# Altium schematic sheet STB_ValidationBoard.SchDoc: STB Validation Board
size A3; Author: mayerph; DrawnBy: mayerph; Organization: PBL; Revision: A; SheetNumber: 1; SheetTotal: 4
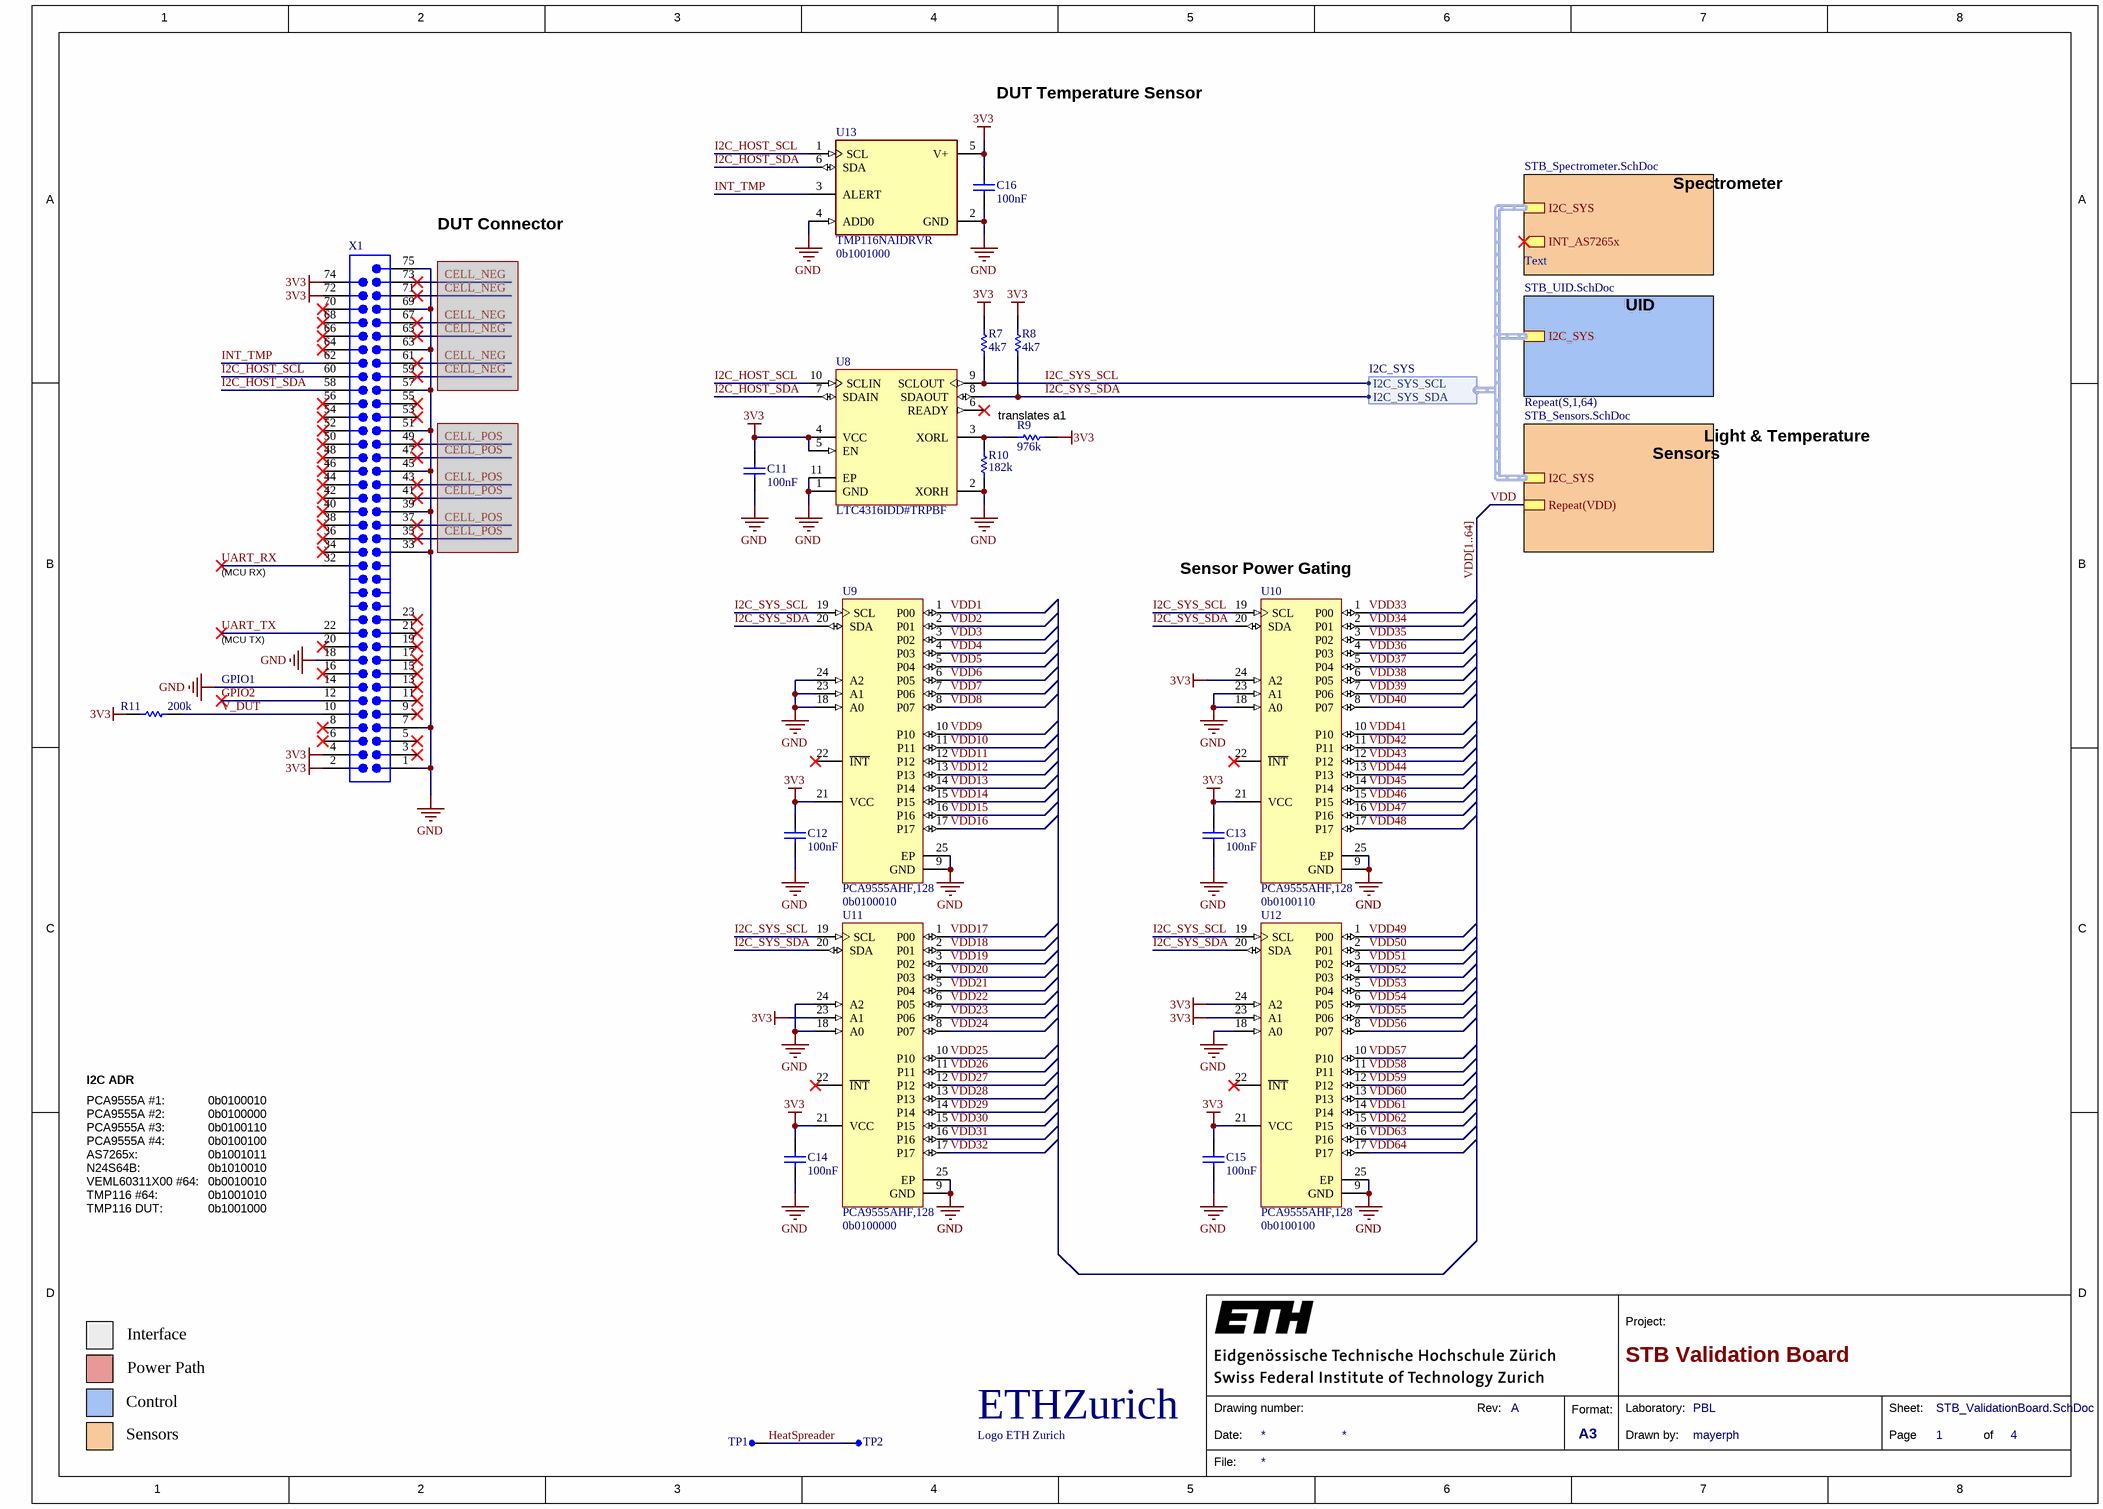
[diagram p0: STB_ValidationBoard.SchDoc]

## Parts
A1  Logo ETH Zurich  [eth-zurich_5mm]  (no BOM)
C11  100nF  [CAPC1050X55X23LL05T13]
C12  100nF  [CAPC1050X55X23LL05T13]
C13  100nF  [CAPC1050X55X23LL05T13]
C14  100nF  [CAPC1050X55X23LL05T13]
C15  100nF  [CAPC1050X55X23LL05T13]
C16  100nF  [CAPC1050X55X23LL05T13]
R7  4k7  [RESC1005X40X25LL05T10]
R8  4k7  [RESC1005X40X25LL05T10]
R9  976k  [RESC1005X40X25LL05T05]
R10  182k  [RESC1005X40X25LL05T05]
R11  200k  [RESC1005X40X25LL05T10]
TP1  testPoint_1mm  [TP-SM-C-100]  (value not drawn)  (no BOM)
TP2  testPoint_1mm  [TP-SM-C-100]  (value not drawn)  (no BOM)
U8  LTC4316IDD#TRPBF  [DFN10(3x3)_N]
U9  PCA9555AHF,128  [RGE0024C]
U10  PCA9555AHF,128  [RGE0024C]
U11  PCA9555AHF,128  [RGE0024C]
U12  PCA9555AHF,128  [RGE0024C]
U13  TMP116NAIDRVR  Address: 0b1001000  [FP-DRV0006B-MFG]
X1  CONN PWR CARD EDGE PCB SLOT MALE  [CON-67_0.5MM_PCB_SLOT]  (value not drawn)  (no BOM)

## Sub-sheets
Repeat(S,1,64) = STB_Sensors.SchDoc: I2C_SYS (harness I2C_SYS), Repeat(VDD)
SP = STB_Spectrometer.SchDoc: I2C_SYS (harness I2C_SYS), INT_AS7265x (out)
TC = STB_UID.SchDoc: I2C_SYS (harness I2C_SYS)

## Harnesses
I2C_SYS: I2C_SYS_SDA, I2C_SYS_SCL

## Nets
3V3: C11.2 C12.2 C13.2 C14.2 C15.2 C16.2 R7.2 R8.2 R9.1 R11.2 U8.4(VCC) U8.5(EN) U9.21(VCC) U10.21(VCC) U10.24(A2) U11.21(VCC) U11.23(A1) U12.21(VCC) U12.23(A1) U12.24(A2) U13.5(V+) X1.2 X1.4 X1.72 X1.74
GND: C11.1 C12.1 C13.1 C14.1 C15.1 C16.1 R10.1 U8.1(GND) U8.2(XORH) U8.11(EP) U9.9(GND) U9.18(A0) U9.23(A1) U9.24(A2) U9.25(EP) U10.9(GND) U10.18(A0) U10.23(A1) U10.25(EP) U11.9(GND) U11.18(A0) U11.24(A2) U11.25(EP) U12.9(GND) U12.18(A0) U12.25(EP) U13.2(GND) U13.4(ADD0) X1.1 X1.7 X1.14 X1.18 X1.33 X1.39 X1.45 X1.51 X1.57 X1.63 X1.69 X1.75
GPIO2: X1.12
HeatSpreader: TP1.1(TP) TP2.1(TP)
I2C_HOST_SCL: U8.10(SCLIN) U13.1(SCL) X1.60
I2C_HOST_SDA: U8.7(SDAIN) U13.6(SDA) X1.58
I2C_SYS_SCL: R7.1 U8.9(SCLOUT) U9.19(SCL) U10.19(SCL) U11.19(SCL) U12.19(SCL) ; sheet SP/I2C_SYS.I2C_SYS_SCL
I2C_SYS_SDA: R8.1 U8.8(SDAOUT) U9.20(SDA) U10.20(SDA) U11.20(SDA) U12.20(SDA) ; sheet SP/I2C_SYS.I2C_SYS_SDA
INT_TMP: U13.3(ALERT) X1.62
UART_RX: X1.32
UART_TX: X1.22
V_DUT: R11.1 X1.10
VDD: sheet Repeat(S,1,64)/Repeat(VDD)
VDD1: U9.1(P00)
VDD2: U9.2(P01)
VDD3: U9.3(P02)
VDD4: U9.4(P03)
VDD5: U9.5(P04)
VDD6: U9.6(P05)
VDD7: U9.7(P06)
VDD8: U9.8(P07)
VDD9: U9.10(P10)
VDD10: U9.11(P11)
VDD11: U9.12(P12)
VDD12: U9.13(P13)
VDD13: U9.14(P14)
VDD14: U9.15(P15)
VDD15: U9.16(P16)
VDD16: U9.17(P17)
VDD17: U11.1(P00)
VDD18: U11.2(P01)
VDD19: U11.3(P02)
VDD20: U11.4(P03)
VDD21: U11.5(P04)
VDD22: U11.6(P05)
VDD23: U11.7(P06)
VDD24: U11.8(P07)
VDD25: U11.10(P10)
VDD26: U11.11(P11)
VDD27: U11.12(P12)
VDD28: U11.13(P13)
VDD29: U11.14(P14)
VDD30: U11.15(P15)
VDD31: U11.16(P16)
VDD32: U11.17(P17)
VDD33: U10.1(P00)
VDD34: U10.2(P01)
VDD35: U10.3(P02)
VDD36: U10.4(P03)
VDD37: U10.5(P04)
VDD38: U10.6(P05)
VDD39: U10.7(P06)
VDD40: U10.8(P07)
VDD41: U10.10(P10)
VDD42: U10.11(P11)
VDD43: U10.12(P12)
VDD44: U10.13(P13)
VDD45: U10.14(P14)
VDD46: U10.15(P15)
VDD47: U10.16(P16)
VDD48: U10.17(P17)
VDD49: U12.1(P00)
VDD50: U12.2(P01)
VDD51: U12.3(P02)
VDD52: U12.4(P03)
VDD53: U12.5(P04)
VDD54: U12.6(P05)
VDD55: U12.7(P06)
VDD56: U12.8(P07)
VDD57: U12.10(P10)
VDD58: U12.11(P11)
VDD59: U12.12(P12)
VDD60: U12.13(P13)
VDD61: U12.14(P14)
VDD62: U12.15(P15)
VDD63: U12.16(P16)
VDD64: U12.17(P17)
NetR9_2: R9.2 R10.2 U8.3(XORL)

Not connected (* = marked no-connect by the designer): U8 6(READY)*; U9 22(~{INT})*; U10 22(~{INT})*; U11 22(~{INT})*; U12 22(~{INT})*; X1 3* 5* 6* 8* 9* 11* 13* 15* 16* 17* 19* 20* 21* 23* 34* 35* 36* 37* 38* 40* 41* 42* 43* 44* 46* 47* 48* 49* 50* 52(51)* 53* 54(52)* 55* 56(53)* 59* 61* 64* 65* 66* 67* 68* 70* 71* 73*

## Buses and harness runs
bus VDD[1..64]
harness sheet Repeat(S,1,64)/I2C_SYS = sheet SP/I2C_SYS = sheet TC/I2C_SYS

## Notes on the sheet
- DUT Temperature Sensor
- (near X1) DUT Connector
- Spectrometer
- Text
- UID
- (near R9) translates a1
- Light & Temperature
- Sensors
- (MCU RX)
- Sensor Power Gating
- (MCU TX)
- GPIO1
- 0b0100010
- 0b0100110
- I2C ADR
- PCA9555A #1:
  PCA9555A #2:
  PCA9555A #3:
  PCA9555A #4:
  AS7265x:
  N24S64B:
  VEML60311X00 #64:
  TMP116 #64:
  TMP116 DUT:
- 0b0100010
  0b0100000
  0b0100110
  0b0100100
  0b1001011
  0b1010010
  0b0010010
  0b1001010
  0b1001000
- (near U11) 0b0100000
- (near U12) 0b0100100
- Interface
- Power Path
- Control
- 1
- 2
- 3
- 4
- 5
- 6
- 7
- 8
- A
- B
- C
- D
- Project:
- Date:
- Drawing number:
- Rev:
- Format:
- A3
- Drawn by:
- Laboratory:
- Page
- Sheet:
- of
- File:
- (in symbol CMP-00038-1) ETHZurich

## Library data of the parts
A1 = CMP-00038-1
C11-C16 = CMP-2000-05439-1: Chip Capacitor, 100 nF, +/- 10%, 16 V, -55 to 125 degC, 0402 (1005 Metric), RoHS, Tape and Reel; Manufacturer: Samsung Electro-Mechanics; Manufacturer Part Number: CL05B104KO5NNNC; Dielectric: X7R; Rated Voltage: 16V; Dielectric Material: Ceramic; Multilayer: Yes; Case Size/Dimension: 0402; Tolerance (%): ±10%; Value: 100nF; Manufacturer URL: http://www.samsungsem.com/global/index.jsp; Datasheet URL: https://datasheet.ciiva.com/29198/458718-da-01-en-vs-kondensator-0402-29198423.pdf; Datasheet Version: Nov-10; Supplier 1: Digi-Key; Supplier Part Number 1: 1276-1001-6-ND; RoHS: Yes; Category: Ceramic Capacitors; Stock 1: 24854634; Pricing 1: 1=0.10000, 10=0.02400, 50=0.01300, 100=0.01050, 500=0.00752, 1000=0.00592, 2500=0.00538, 5000=0.00495 (USD); Mount: Surface Mount; Number of Pins: 2; Package Shape: Rectangular; Size Code: 0402; Terminal Finish: Nickel; Min Operating Temperature: -55°C; Max Operating Temperature: 125°C; JESD-609 Code: e3; Capacitor Type: Ceramic; Negative Tolerance: 10%; Packaging: Tape and Reel; Positive Tolerance: 10%; Rated DC Voltage (URdc): 16V; Temperature Characteristics Code: X7R; Termination: Wraparound; Package Style: SMTMeter; Length: 1mm; Width: 0.5mm; Height: 0.55mm; REACH SVHC: Yes; RoHS Compliant: Yes; ComponentLink1URL: https://datasheet.ciiva.com:443/pdfs/VipMasterIC/IC/SEMS/SEMS-S-A0008384515/SEMS-S-A0008872921-1.pdf?src-supplier=IHS+Markit; ComponentLink1Description: https://datasheet.ciiva.com:443/pdfs/VipMasterIC/IC/SEMS/SEMS-S-A0008384515/SEMS-S-A0008872921-1.pdf?src-supplier=IHS+Markit; ComponentLink2URL: https://datasheet.ciiva.com/26920/getdatasheetpartid-359683-26920169.pdf?src-supplier=Verical; ComponentLink2Description: https://datasheet.ciiva.com/26920/getdatasheetpartid-359683-26920169.pdf?src-supplier=Verical; ComponentLink3URL: https://datasheet.ciiva.com/29198/458718-da-01-en-vs-kondensator-0402-29198423.pdf?src-supplier=Conrad; ComponentLink3Description: https://datasheet.ciiva.com/29198/458718-da-01-en-vs-kondensator-0402-29198423.pdf?src-supplier=Conrad; ComponentLink4URL: https://datasheet.ciiva.com/26309/mlcc-catalogdownload2013-eng-26309003.pdf?src-supplier=Distrelec; ComponentLink4Description: https://datasheet.ciiva.com/26309/mlcc-catalogdownload2013-eng-26309003.pdf?src-supplier=Distrelec; ComponentLink5URL: https://datasheet.ciiva.com/16208/cl05b104kq5nnnc-16208343.pdf?src-supplier=Future+Electronics; ComponentLink5Description: https://datasheet.ciiva.com/16208/cl05b104kq5nnnc-16208343.pdf?src-supplier=Future+Electronics
R7 R8 = CMP-1011-00586-2: Manufacturer: Yageo / Phycomp; Part Number: RC0402FR-074K7L; Tolerance: 1%; Rated Power Dissipation (P): 62.5mW; Rated Temperature: 70°C; Value: 4.7 kOhm; Temperature Coefficient: 100ppm/°C; Working Voltage: 50V; Additional Feature: LASER TRIMMABLE; Package Height: 0.35mm; Package Length: 1mm; Package Width: 0.5mm; Supplier 1: Digi-Key; Supplier Part Number 1: 311-4.7KLRDKR-ND; Manufacturer Part Number: RC0402FR-074K7L; RoHS: Yes; Category: Chip SMD Resistors; Stock 1: 23638739; Pricing 1: 1=0.10000, 10=0.01500, 100=0.00600, 1000=0.00267, 2500=0.00232, 5000=0.00192 (USD); Mount: Surface Mount; Number of Pins: 2; Package Shape: Rectangular; Size Code: 0402; Terminal Finish: Nickel; Min Operating Temperature: -55°C; Max Operating Temperature: 155°C; Resistor Type: FIXED RESISTOR; Packaging: Tape and Reel; Technology: METAL GLAZE/THICK FILM; Termination: Wraparound; JESD-609 Code: e3; Construction: Chip; Package Style: SMTMeter; REACH SVHC: Yes; RoHS Compliant: Yes; ComponentLink1URL: https://datasheet.ciiva.com:443/pdfs/VipMasterIC/IC/YAGO/YAGO-S-A0008145938/YAGO-S-A0008145938-1.pdf?src-supplier=IHS+Markit; ComponentLink1Description: https://datasheet.ciiva.com:443/pdfs/VipMasterIC/IC/YAGO/YAGO-S-A0008145938/YAGO-S-A0008145938-1.pdf?src-supplier=IHS+Markit; ComponentLink2URL: https://datasheet.ciiva.com/22661/1686128-22661342.pdf?src-supplier=Element14; ComponentLink2Description: https://datasheet.ciiva.com/22661/1686128-22661342.pdf?src-supplier=Element14; ComponentLink3URL: https://datasheet.ciiva.com/7850/1018594-7850022.pdf?src-supplier=Element14; ComponentLink3Description: https://datasheet.ciiva.com/7850/1018594-7850022.pdf?src-supplier=Element14; ComponentLink4URL: https://datasheet.ciiva.com/7850/1018594-7850023.pdf?src-supplier=Element14; ComponentLink4Description: https://datasheet.ciiva.com/7850/1018594-7850023.pdf?src-supplier=Element14; ComponentLink5URL: https://datasheet.ciiva.com/15215/getdatasheetpartid-328119-15215035.pdf?src-supplier=Verical; ComponentLink5Description: https://datasheet.ciiva.com/15215/getdatasheetpartid-328119-15215035.pdf?src-supplier=Verical
R9 = CMP-2002-01120-1: Manufacturer: Panasonic; Part Number: ERJ-2RKF9763X; Tolerance: 1%; Rated Power Dissipation (P): 100mW; Rated Temperature: 70°C; Value: 976 kOhm; Temperature Coefficient: 100ppm/°C; Working Voltage: 50V; Package Height: 0.35mm; Package Length: 1mm; Package Width: 0.5mm; Reference Standard: AEC-Q200; Supplier 1: Digi-Key; Supplier Part Number 1: P976KLDKR-ND; Manufacturer Part Number: ERJ-2RKF9763X; RoHS: Yes; Category: Chip SMD Resistors; Stock 1: 136638; Pricing 1: 1=0.10000, 10=0.03300, 100=0.01330, 1000=0.00599, 2500=0.00520, 5000=0.00429 (USD); Mount: Surface Mount; Number of Pins: 2; Size Code: 0402; Terminal Finish: Nickel; Package Shape: Rectangular; Min Operating Temperature: -55°C; Max Operating Temperature: 155°C; Resistor Type: FIXED RESISTOR; Construction: Rectangular; Package Style: SMTMeter; Packaging: Tape and Reel; Termination: Wraparound; JESD-609 Code: e3; Technology: METAL GLAZE/THICK FILM; REACH SVHC: Yes; RoHS Compliant: Yes; ComponentLink1URL: https://datasheet.ciiva.com:443/pdfs/VipMasterIC/IC/PANA/PANA-S-A0009889626/PANA-S-A0009889626-1.pdf?src-supplier=IHS+Markit; ComponentLink1Description: https://datasheet.ciiva.com:443/pdfs/VipMasterIC/IC/PANA/PANA-S-A0009889626/PANA-S-A0009889626-1.pdf?src-supplier=IHS+Markit; ComponentLink2URL: https://datasheet.ciiva.com/43467/1678782-43467581.pdf?src-supplier=Farnell; ComponentLink2Description: https://datasheet.ciiva.com/43467/1678782-43467581.pdf?src-supplier=Farnell; ComponentLink3URL: https://datasheet.ciiva.com/46372/1678782-46372911.pdf?src-supplier=Element14; ComponentLink3Description: https://datasheet.ciiva.com/46372/1678782-46372911.pdf?src-supplier=Element14; ComponentLink4URL: https://datasheet.ciiva.com/22668/1678782-22668415.pdf?src-supplier=Element14; ComponentLink4Description: https://datasheet.ciiva.com/22668/1678782-22668415.pdf?src-supplier=Element14; ComponentLink5URL: https://datasheet.ciiva.com/16758/70260748-16758903.pdf?src-supplier=Allied+Electronics; ComponentLink5Description: https://datasheet.ciiva.com/16758/70260748-16758903.pdf?src-supplier=Allied+Electronics; ComponentLink6URL: https://datasheet.ciiva.com/9179/aoa0000ce2-9179357.pdf?src-supplier=Avnet; ComponentLink6Description: https://datasheet.ciiva.com/9179/aoa0000ce2-9179357.pdf?src-supplier=Avnet; ComponentLink7URL: https://datasheet.ciiva.com/30176/aoa0000ce2-30176831.pdf?src-supplier=Onlinecomponents.com; ComponentLink7Description: https://datasheet.ciiva.com/30176/aoa0000ce2-30176831.pdf?src-supplier=Onlinecomponents.com
R10 = CMP-2002-08256-1: Manufacturer: Vishay Dale; Part Number: CRCW0402182KFKED; Value: 182 kOhm; Tolerance: 1%; Rated Power Dissipation (P): 63mW; Resistance: 182kR; Temperature Coefficient: 100ppm/°C; Working Voltage: 50V; Rated Temperature: 70°C; Package Height: 0.35mm; Package Length: 1mm; Package Width: 0.5mm; Reference Standard: AEC-Q200; Supplier 1: Digi-Key; Supplier Part Number 1: 541-182KLDKR-ND; Manufacturer Part Number: CRCW0402182KFKED; RoHS: Yes; Category: Chip SMD Resistors; Stock 1: 76709; Pricing 1: 1=0.10000, 10=0.03600, 100=0.01460, 1000=0.00656, 2500=0.00569, 5000=0.00470 (USD); Mount: Surface Mount; Number of Pins: 2; Size Code: 0402; Terminal Finish: Nickel; Package Shape: Rectangular; Min Operating Temperature: -55°C; Max Operating Temperature: 155°C; JESD-609 Code: e3; Resistor Type: FIXED RESISTOR; Construction: Chip; Package Style: SMTMeter; Packaging: Tape and Reel; Technology: METAL GLAZE/THICK FILM; Termination: Wraparound; Reach SVHC Compliant: Yes; RoHS Compliant: Yes; ComponentLink1URL: https://datasheet.ciiva.com:443/pdfs/VipMasterIC/IC/VISH/VISH-S-A0007266705/VISH-S-A0007266705-1.pdf?src-supplier=IHS+Markit; ComponentLink1Description: https://datasheet.ciiva.com:443/pdfs/VipMasterIC/IC/VISH/VISH-S-A0007266705/VISH-S-A0007266705-1.pdf?src-supplier=IHS+Markit; ComponentLink2URL: https://datasheet.ciiva.com/3256/dcrcwe3-3256117.pdf?src-supplier=Avnet; ComponentLink2Description: https://datasheet.ciiva.com/3256/dcrcwe3-3256117.pdf?src-supplier=Avnet; ComponentLink3URL: https://datasheet.ciiva.com/2463/dcrcwe3-2463286.pdf?src-supplier=Digi-Key; ComponentLink3Description: https://datasheet.ciiva.com/2463/dcrcwe3-2463286.pdf?src-supplier=Digi-Key; ComponentLink4URL: https://datasheet.ciiva.com/5545/dcrcwe3-109170-5545910.pdf?src-supplier=Mouser; ComponentLink4Description: https://datasheet.ciiva.com/5545/dcrcwe3-109170-5545910.pdf?src-supplier=Mouser; ComponentLink5URL: https://datasheet.ciiva.com/2463/dcrcwe3-2463287.pdf?src-supplier=Digi-Key; ComponentLink5Description: https://datasheet.ciiva.com/2463/dcrcwe3-2463287.pdf?src-supplier=Digi-Key; ComponentLink6URL: https://datasheet.ciiva.com/7714/1697337-7714183.pdf?src-supplier=Element14; ComponentLink6Description: https://datasheet.ciiva.com/7714/1697337-7714183.pdf?src-supplier=Element14; ComponentLink7URL: https://datasheet.ciiva.com/2463/dcrcwe3-2463288.pdf?src-supplier=Digi-Key; ComponentLink7Description: https://datasheet.ciiva.com/2463/dcrcwe3-2463288.pdf?src-supplier=Digi-Key; ComponentLink8URL: https://datasheet.ciiva.com/16785/70201119-16785993.pdf?src-supplier=Allied+Electronics; ComponentLink8Description: https://datasheet.ciiva.com/16785/70201119-16785993.pdf?src-supplier=Allied+Electronics; ComponentLink9URL: https://datasheet.ciiva.com/7714/1697337-7714365.pdf?src-supplier=Element14; ComponentLink9Description: https://datasheet.ciiva.com/7714/1697337-7714365.pdf?src-supplier=Element14
R11 = CMP-2002-07497-1: Part Number: RC0402FR-07200KL; Manufacturer: Yageo / Phycomp; Tolerance: 1%; Rated Power Dissipation (P): 62.5mW; Rated Temperature: 70°C; Value: 200 kOhm; Temperature Coefficient: 100ppm/°C; Working Voltage: 50V; Additional Feature: LASER TRIMMABLE; Package Height: 0.35mm; Package Length: 1mm; Package Width: 0.5mm; Supplier 1: Digi-Key; Supplier Part Number 1: 311-200KLRDKR-ND; Manufacturer Part Number: RC0402FR-07200KL; RoHS: Yes; Category: Chip SMD Resistors; Stock 1: 2033311; Pricing 1: 1=0.10000, 10=0.01500, 100=0.00600, 1000=0.00267, 2500=0.00232, 5000=0.00192 (USD); Mount: Surface Mount; Number of Pins: 2; Size Code: 0402; Package Shape: Rectangular; Terminal Finish: Nickel; Min Operating Temperature: -55°C; Max Operating Temperature: 155°C; Resistor Type: FIXED RESISTOR; Construction: Chip; Package Style: SMTMeter; Technology: METAL GLAZE/THICK FILM; Termination: Wraparound; Packaging: Tape and Reel; JESD-609 Code: e3; REACH SVHC: Yes; RoHS Compliant: Yes; ComponentLink1URL: https://datasheet.ciiva.com:443/pdfs/VipMasterIC/IC/YAGO/YAGO-S-A0008145938/YAGO-S-A0008145938-1.pdf?src-supplier=IHS+Markit; ComponentLink1Description: https://datasheet.ciiva.com:443/pdfs/VipMasterIC/IC/YAGO/YAGO-S-A0008145938/YAGO-S-A0008145938-1.pdf?src-supplier=IHS+Markit; ComponentLink2URL: https://datasheet.ciiva.com/7849/1018594-7849897.pdf?src-supplier=Element14; ComponentLink2Description: https://datasheet.ciiva.com/7849/1018594-7849897.pdf?src-supplier=Element14; ComponentLink3URL: https://datasheet.ciiva.com/7849/1018594-7849896.pdf?src-supplier=Element14; ComponentLink3Description: https://datasheet.ciiva.com/7849/1018594-7849896.pdf?src-supplier=Element14; ComponentLink4URL: https://datasheet.ciiva.com/46394/1018594-46394953.pdf?src-supplier=Element14; ComponentLink4Description: https://datasheet.ciiva.com/46394/1018594-46394953.pdf?src-supplier=Element14; ComponentLink5URL: https://datasheet.ciiva.com/2453/pyu-r-int-thick-7-2453557.pdf?src-supplier=Digi-Key; ComponentLink5Description: https://datasheet.ciiva.com/2453/pyu-r-int-thick-7-2453557.pdf?src-supplier=Digi-Key; ComponentLink6URL: https://datasheet.ciiva.com/2453/pyu-r-int-thick-7-2453558.pdf?src-supplier=Digi-Key; ComponentLink6Description: https://datasheet.ciiva.com/2453/pyu-r-int-thick-7-2453558.pdf?src-supplier=Digi-Key; ComponentLink7URL: https://datasheet.ciiva.com/2453/pyu-r-int-thick-7-2453556.pdf?src-supplier=Digi-Key; ComponentLink7Description: https://datasheet.ciiva.com/2453/pyu-r-int-thick-7-2453556.pdf?src-supplier=Digi-Key; ComponentLink8URL: https://datasheet.ciiva.com/12667/pyu-rc0402-51-rohs-l-6-r-12667911.pdf?src-supplier=Mouser; ComponentLink8Description: https://datasheet.ciiva.com/12667/pyu-rc0402-51-rohs-l-6-r-12667911.pdf?src-supplier=Mouser; ComponentLink9URL: https://datasheet.ciiva.com/15189/getdatasheetpartid-323720-15189381.pdf?src-supplier=Verical; ComponentLink9Description: https://datasheet.ciiva.com/15189/getdatasheetpartid-323720-15189381.pdf?src-supplier=Verical; ComponentLink10URL: https://datasheet.ciiva.com/16740/pyu-rc0402-51-rohs-l-6-r-16740636.pdf?src-supplier=Future+Electronics; ComponentLink10Description: https://datasheet.ciiva.com/16740/pyu-rc0402-51-rohs-l-6-r-16740636.pdf?src-supplier=Future+Electronics
TP1 TP2 = testPoint_1mm: testPoint 1mm
U8 = CMP-02068-1: Single I2C/SMBus Address Translator; Manufacturer: Analog Devices / Linear Technology; Interface IC Type: INTERFACE CIRCUIT; Max Supply Voltage: 5.5V; Min Supply Voltage: 2.25V; Number of Functions: 1; Package Body Material: Plastic; Supply Voltage-Nom: 3.3V; Height - Seated (Max): 0.8mm; JESD-30 Code: S-PDSO-N10; Length: 3mm; Max Operating Temperature: 85°C; Min Operating Temperature: -40°C; Number of Pins: 10; Package Code: VSON; Package Shape: Square; Package Style: SMALL OUTLINE, VERY THIN PROFILEMeter; REACH SVHC: Yes; RoHS Compliant: Yes; Surface Mount: Yes; Technology: CMOS; Temperature Grade: INDUSTRIAL; Terminal Form: No Lead; Terminal Pitch: 0.5mm; Terminal Position: DUAL; Width: 3mm; Supplier 1: Digi-Key; Supplier Part Number 1: 505-LTC4316IDD#TRPBFDKR-ND; Manufacturer Part Number: LTC4316IDD#TRPBF; RoHS: Yes; Category: Interface ICs; Stock 1: 531; Pricing 1: 1=5.70000, 10=5.12100, 25=4.84160, 100=4.19600, 250=3.98084, 500=3.57198, 1000=3.04500 (USD); ComponentLink1URL: https://datasheet.ciiva.com:443/pdfs/VipMasterIC/IC/LITC/LITC-S-A0001226702/LITC-S-A0001226702-1.pdf?src-supplier=IHS+Markit; ComponentLink1Description: https://datasheet.ciiva.com:443/pdfs/VipMasterIC/IC/LITC/LITC-S-A0001226702/LITC-S-A0001226702-1.pdf?src-supplier=IHS+Markit; ComponentLink2URL: http://www.linear.com/docs/46527?src-supplier=Digi-Key; ComponentLink2Description: http://www.linear.com/docs/46527?src-supplier=Digi-Key
U9-U12 = CMP-0314-00043-2: Manufacturer: NXP Semiconductors; Package Body Material: Plastic; Number of Bits: 16; Number of Ports: 2; Package Equivalence Code: LCC24,.16SQ,20; Power Supplies: 1.8/5V; Max Supply Voltage: 5.5V; Min Supply Voltage: 1.65V; Supply Voltage-Nom: 1.8V; Qualification Status: Not Qualified; Supplier 1: Digi-Key; Supplier Part Number 1: 568-9942-1-ND; Manufacturer Part Number: PCA9555AHF,128; RoHS: Yes; Category: Interface ICs; Stock 1: 565; Pricing 1: 1=2.47000, 10=2.22300, 25=2.09680, 100=1.78650, 250=1.67748, 500=1.46780, 1000=1.32601 (USD); Package Code: VQCCN; Number of Pins: 24; Package Shape: Square; Min Operating Temperature: -40°C; Max Operating Temperature: 85°C; Moisture Sensitivity Level: 1; Number of I/O Lines: 16; Package Style: CHIP CARRIER, VERY THIN PROFILEMeter; Surface Mount: Yes; Technology: CMOS; Terminal Form: No Lead; Terminal Position: QUAD; Length: 4mm; Width: 4mm; Height - Seated (Max): 0.8mm; Terminal Pitch: 0.5mm; Temperature Grade: INDUSTRIAL; REACH SVHC: Yes; RoHS Compliant: Yes; ComponentLink1URL: https://datasheet.ciiva.com:443/pdfs/VipMasterIC/IC/PHGL/PHGL-S-A0001284358/PHGL-S-A0001284358-1.pdf?src-supplier=IHS+Markit; ComponentLink1Description: https://datasheet.ciiva.com:443/pdfs/VipMasterIC/IC/PHGL/PHGL-S-A0001284358/PHGL-S-A0001284358-1.pdf?src-supplier=IHS+Markit; ComponentLink2URL: https://datasheet.ciiva.com/12072/pca9555a-211666-12072629.pdf?src-supplier=Mouser; ComponentLink2Description: https://datasheet.ciiva.com/12072/pca9555a-211666-12072629.pdf?src-supplier=Mouser; ComponentLink3URL: https://datasheet.ciiva.com/6633/pca9555a-6633081.pdf?src-supplier=Digi-Key; ComponentLink3Description: https://datasheet.ciiva.com/6633/pca9555a-6633081.pdf?src-supplier=Digi-Key; ComponentLink4URL: https://datasheet.ciiva.com/6633/design-con-2003-tecforum-i2c-bus-overview-6633083.pdf?src-supplier=Digi-Key; ComponentLink4Description: https://datasheet.ciiva.com/6633/design-con-2003-tecforum-i2c-bus-overview-6633083.pdf?src-supplier=Digi-Key; ComponentLink5URL: https://datasheet.ciiva.com/6633/design-con-2003-tecforum-i2c-bus-overview-6633082.pdf?src-supplier=Digi-Key; ComponentLink5Description: https://datasheet.ciiva.com/6633/design-con-2003-tecforum-i2c-bus-overview-6633082.pdf?src-supplier=Digi-Key; ComponentLink6URL: https://datasheet.ciiva.com/46433/1845292-46433837.pdf?src-supplier=Element14; ComponentLink6Description: https://datasheet.ciiva.com/46433/1845292-46433837.pdf?src-supplier=Element14
U13 = CMP-04948-000013-1: SENSOR DIGITAL -55C-125C 6WSON; Manufacturer: Texas Instruments; Sensor Output: I2C,SMBus; Max Junction Temp: +150°C; Standoff Height: 0mm; Min Supply Voltage: 1.9V; Max Supply Voltage: 5.5V; Resolution: 16bits; Operating Supply Current: 3.5-135uA; Package Shape/Style: Square; Accuracy-Max (Cel): 0.5°C; Number of Bits: 16; Output Interface Type: 2-Wire; Sensors/Transducers Type: TEMPERATURE SENSOR,SWITCH/DIGITAL OUTPUT,SERIAL; Body Breadth: 2inch; Body Height: 0.8mm; Body Length or Diameter: 2mm; Manufacturer Part Number: TMP116NAIDRVR; Temperature Range Low: -55°C; Temperature: -55°C to +125°C; Ipc Land Pattern Name: DFN200X200X80-6; Device Class L1: Sensors; Package: DRV0006B; Interface: I2C,SMBus; Device Class L3: unset; Ambient Temperature Range Low: -55°C; Lead Free: Yes; Height: 0.8mm; Temperature Range High: +125°C; Digikey Description: SENSOR DIGITAL -55C-125C 6WSON; RoHS: TRUE; Mouser Description: ±0.2°C Accurate Digital Temperature Sensor With NV Memory 6-WSON -55 to 125; Ambient Temperature Range High: +150°C; ComponentLink2Description: Datasheet; Category: IC; Device Class L2: Temperature and Humidity Sensors; ComponentLink2URL: https://www.ti.com/lit/ds/symlink/tmp116.pdf; Octopart: https://octopart.com/tmp116naidrvr-texas+instruments-82367758; Automotive: No; Supplier 1: Digi-Key; Supplier Part Number 1: 296-48306-6-ND; Stock 1: 6627; Pricing 1: 1=2.48000, 10=2.22500, 25=2.09880, 100=1.78820, 250=1.67904, 500=1.46916, 1000=1.26720 (USD); Mount: Surface Mount; Housing Material: Plastic; Terminal Finish: Nickel; Min Operating Temperature: -55°C; Max Operating Temperature: 150°C; JESD-609 Code: e4; Termination: Solder; REACH SVHC: Yes; RoHS Compliant: Yes; ComponentLink1URL: https://www.ti.com:443/lit/ds/symlink/tmp116.pdf?src-supplier=IHS+Markit; ComponentLink1Description: https://www.ti.com:443/lit/ds/symlink/tmp116.pdf?src-supplier=IHS+Markit; ComponentLink3URL: http://www.ti.com/lit/ds/symlink/tmp116.pdf?src-supplier=Digi-Key; ComponentLink3Description: http://www.ti.com/lit/ds/symlink/tmp116.pdf?src-supplier=Digi-Key
X1 = CMP-01224-1: Mates with 2199119-4 - No BOM; Number of Positions: 67; Pitch: 0.5mm; Card Thickness: 0.8mm; Card Type: Non Specified - Dual Edge; Gender: Male; Mates with: 2199119-4